# Altium schematic sheet 2025-11-30_13-06-011.schdoc
size 293 x 130 mm; SheetNumber: 1; SheetTotal: 1
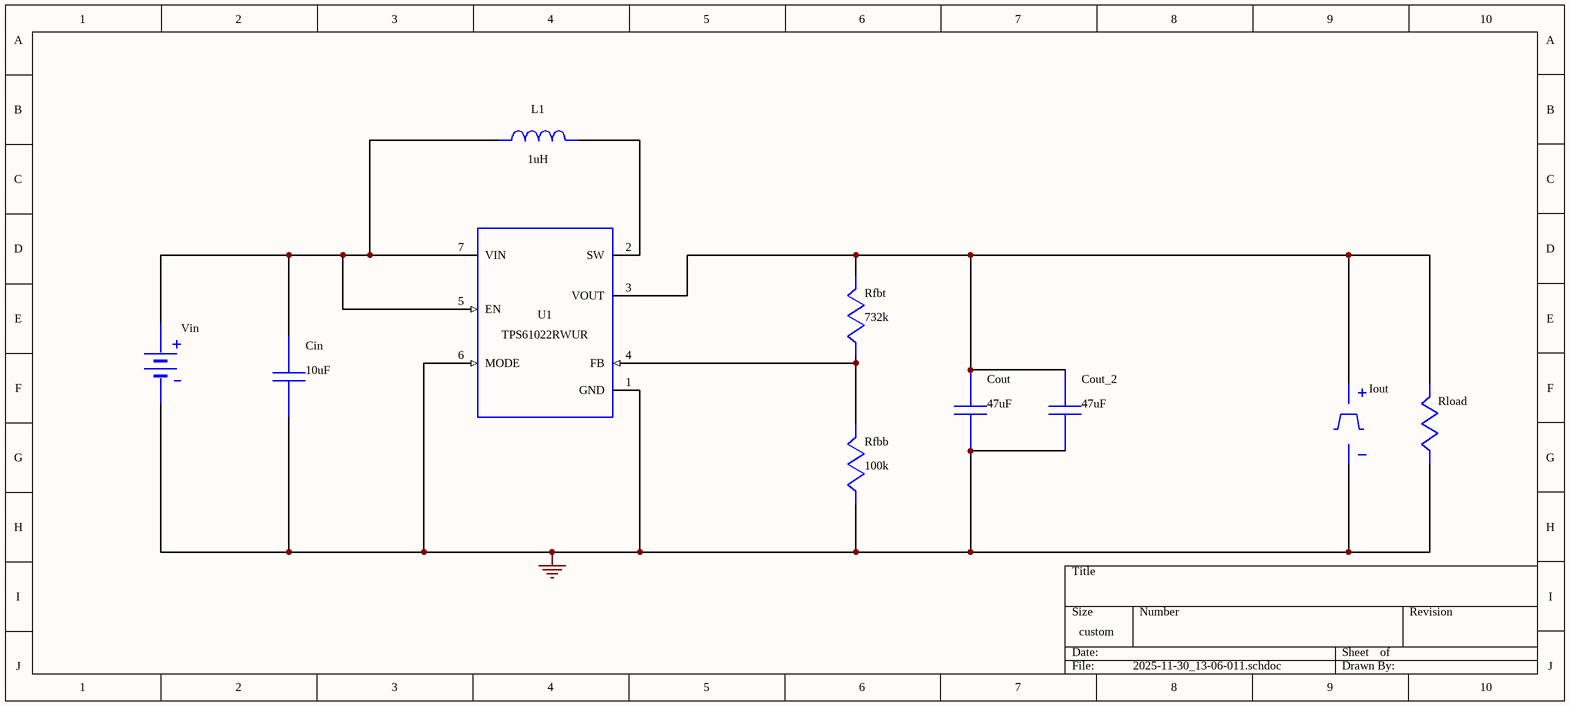
[diagram p0: 2025-11-30_13-06-011.schdoc]

## Parts
Cin  value 10uF  (hidden comment: C0805C106K8PACTU)
Cout  value 47uF  (hidden comment: GRM31CR61A476KE15L)
Cout_2  value 47uF  (hidden comment: GRM31CR61A476KE15L)
Iout  WB_PWL_CURRENT_LOAD  (value not drawn)
L1  value 1uH  (hidden comment: XAL4020-102MEB)
Rfbb  value 100k  (hidden comment: CRCW0402100KFKED)
Rfbt  value 732k  (hidden comment: CRCW0402732KFKED)
Rload  WB_LOAD_RESISTOR  (value not drawn)
U1  TPS61022RWUR
Vin  WB_BATTERY  (value not drawn)

## Nets
0: Cin.2 Cout.2 Cout_2.2 Iout.2(-) Rfbb.2 Rload.2 U1.1(GND) U1.6(MODE) Vin.2(-)
NetCin_1: Cin.1 L1.1 U1.5(EN) U1.7(VIN) Vin.1(+)
NetCout_1: Cout.1 Cout_2.1 Iout.1(+) Rfbt.1 Rload.1 U1.3(VOUT)
NetL1_2: L1.2 U1.2(SW)
NetRfbb_1: Rfbb.1 Rfbt.2 U1.4(FB)

## Library data of the parts
Cin = C0805C106K8PACTU: Manufacturer Name: Kemet; PackageReference: C0805C106K8PACTU; Manufacturer Part Number: C0805C106K8PACTU
Cout Cout_2 = GRM31CR61A476KE15L: GRM31CR61A476KE1; Manufacturer Name: MuRata; PackageReference: GRM31CR61A476KE15L; Manufacturer Part Number: GRM31CR61A476KE15L
Iout = WB_PWL_CURRENT_LOAD: WB_PWL_CURRENT_L; PackageReference: WB_PWL_CURRENT_LOAD; Manufacturer Part Number: WB_PWL_CURRENT_LOAD; Manufacturer Name: WB_PWL_CURRENT_LOAD; Value: N/A
L1 = XAL4020-102MEB: Manufacturer Name: Coilcraft; PackageReference: XAL4020-102MEB; Manufacturer Part Number: XAL4020-102MEB
Rfbb = CRCW0402100KFKED: Manufacturer Name: Vishay-Dale; PackageReference: CRCW0402100KFKED; Manufacturer Part Number: CRCW0402100KFKED
Rfbt = CRCW0402732KFKED: Manufacturer Name: Vishay-Dale; PackageReference: CRCW0402732KFKED; Manufacturer Part Number: CRCW0402732KFKED
U1 = TPS61022RWUR: Manufacturer Name: Texas Instruments; PackageReference: TPS61022RWUR; Manufacturer Part Number: TPS61022RWUR; Value: N/A
Rload = WB_LOAD_RESISTOR: PackageReference: WB_LOAD_RESISTOR; Manufacturer Part Number: WB_LOAD_RESISTOR; Manufacturer Name: WB_LOAD_RESISTOR; Value: N/A
Vin = WB_BATTERY: PackageReference: WB_BATTERY; Manufacturer Part Number: WB_BATTERY; Manufacturer Name: WB_BATTERY; Value: N/A